# EAGLE schematic rgb_comm (EAGLE 6.6.0)
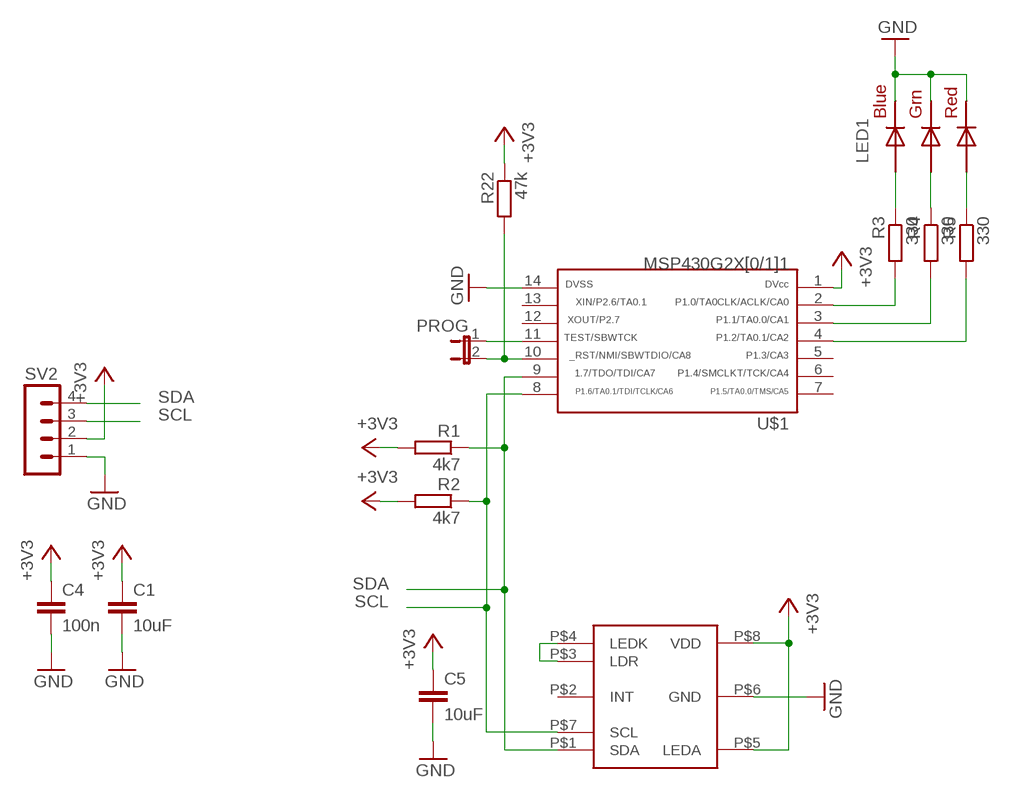
[diagram p0: schematic, sheet 1]

## Parts
C1  10uF  C-EUC0805  [C0805]
C4  100n  C-EUC0805  [C0805]
C5  10uF  C-EUC0805  [C0805]
LED1  ADAFRUIT_RGBLED5050  [ADAFRUIT_RGBLED5050]
PROG  JP1E  [JP1]
R1  4k7  R-EU_M0805  [M0805]
R2  4k7  R-EU_M0805  [M0805]
R3  330  R-EU_M0805  [M0805]
R4  330  R-EU_M0805  [M0805]
R5  330  R-EU_M0805  [M0805]
R22  47k  R-EU_M0805  [M0805]
SV2  MA04-1  [MA04-1]
U$1  G2X[0/1]1---PW14  [PW14]
U$2  APDS9950  [APDS9950]

## Nets
+3V3: C1.1 C4.1 C5.1 R1.2 R2.2 R22.1 SV2.2 U$1.1 U$2.P$5(LEDA) U$2.P$8(VDD)
GND: C1.2 C4.2 C5.2 LED1.4(BLUE_C) LED1.5(RED_C) LED1.6(GREEN_C) SV2.1 U$1.14 U$2.P$6(GND)
N$1: PROG.1 U$1.11
N$2: PROG.2 R22.2 U$1.10
N$3: LED1.3(BLUE_A) R3.1
N$4: LED1.1(GREEN_A) R4.1
N$7: U$2.P$3(LDR) U$2.P$4(LEDK)
N$8: LED1.2(RED_A) R5.1
N$9: R3.2 U$1.2
N$10: R4.2 U$1.3
N$11: R5.2 U$1.4
SCL: R2.1 SV2.3 U$1.8 U$2.P$7(SCL)
SDA: R1.1 SV2.4 U$1.9 U$2.P$1(SDA)
Unconnected: U$1.5 U$1.6 U$1.7 U$1.12 U$1.13 U$2.P$2(INT)

## Library data of the parts
C1 C4 C5 = resistor:C-EU: CAPACITOR, European symbol
LED1 = universal_node:ADAFRUIT_RGBLED: For 5050 RGB LEDs, the order of the LEDs may vary from one manufacturer to another!
PROG = jumper:JP1E: JUMPER
R1-R5 R22 = resistor:R-EU_: RESISTOR, European symbol
SV2 = con-lstb:MA04-1: PIN HEADER; OC_FARNELL: unknown; OC_NEWARK: unknown
U$1 = my_parts:G2X[0/1]1---PW14: MSP430G2X[0/1]1 MSP430G2001, MSP430G2101, MSP430G2201,MSP430G2111, G2211 TSSOP (PW) 14 Pin Package http://focus.ti.com/docs/prod/folders/print/msp430g2111.html
U$2 = my_parts:APDS9950